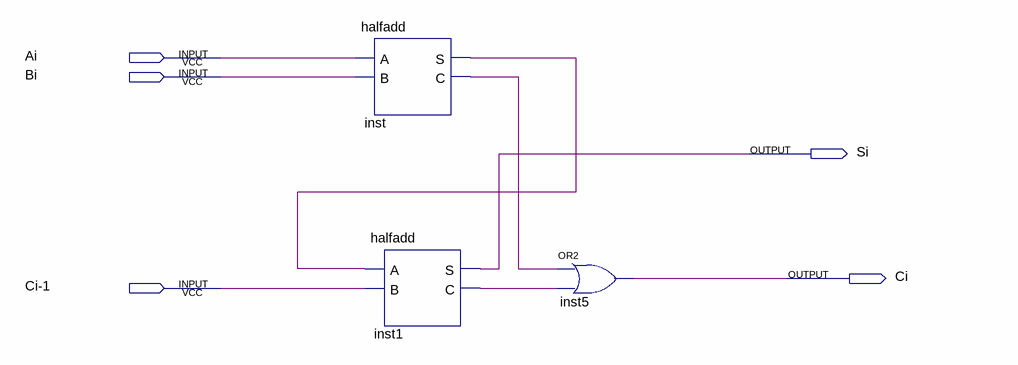
[diagram p0: schematic sheet]
// Quartus schematic fulladd.bdf as structural Verilog: 3 symbols, 5 pins
module fulladd (
  input  Ai,
  input  Bi,
  input  \Ci-1 ,
  output Si,
  output Ci
);

  wire inst1_c, inst_c, inst_s;

  halfadd inst (.A(Ai), .B(Bi), .S(inst_s), .C(inst_c));
  halfadd inst1 (.A(inst_s), .B(\Ci-1 ), .S(Si), .C(inst1_c));
  or inst5 (Ci, inst_c, inst1_c);
endmodule
